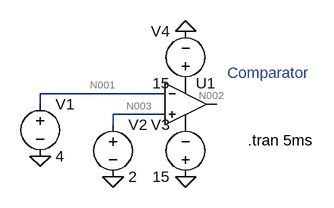
[diagram p0: schematic comparator.asc]
comparator.asc, the LTspice schematic file:
Version 4
SHEET 1 880 680
WIRE 160 144 -32 144
WIRE -32 160 -32 144
WIRE 240 160 224 160
WIRE 160 176 80 176
WIRE 80 192 80 176
FLAG -32 240 0
FLAG 80 272 0
FLAG 192 272 0
FLAG 192 48 0
SYMBOL Opamps\\UniversalOpamp2 192 160 R0
SYMATTR InstName U1
SYMBOL voltage -32 144 R0
WINDOW 123 0 0 Left 0
WINDOW 39 0 0 Left 0
SYMATTR InstName V1
SYMATTR Value 4
SYMBOL voltage 80 176 R0
WINDOW 123 0 0 Left 0
WINDOW 39 0 0 Left 0
SYMATTR InstName V2
SYMATTR Value 2
SYMBOL voltage 192 288 R180
WINDOW 0 24 96 Left 2
WINDOW 3 24 16 Left 2
WINDOW 123 0 0 Left 0
WINDOW 39 0 0 Left 0
SYMATTR InstName V3
SYMATTR Value 15
SYMBOL voltage 192 144 R180
WINDOW 0 24 96 Left 2
WINDOW 3 24 16 Left 2
WINDOW 123 0 0 Left 0
WINDOW 39 0 0 Left 0
SYMATTR InstName V4
SYMATTR Value 15
TEXT 288 216 Left 2 !.tran 5ms
TEXT 256 112 Left 2 ;Comparator

The netlist it stands for:
* comparator.asc
XU1 N003 N001 P001 P002 N002 level.2 Avol=1Meg GBW=10Meg Slew=10Meg ilimit=25m rail=0 Vos=0 phimargin=45 en=0 enk=0 in=0 ink=0 Rin=500Meg  ; pins IN+ IN- V+ V- OUT
V1 N001 0 4
V2 N003 0 2
V3 0 P002 15
V4 P001 0 15
.tran 5ms
* Comparator
.lib UniversalOpamps2.sub
.backanno
.end

* Results of the author's LTspice run, read from the files saved beside the schematic
* Operating Point, zero values left out:
*   V(n002) = -15 V
*   V(p001) = 15 V
*   V(p002) = -15 V
*   V(n001) = 4 V
*   V(n003) = 2 V
*   I(V4) = -3.475 µA
*   I(V3) = -3.287 µA
*   I(V2) = -4 nA
*   I(V1) = -8 nA
*   Ix(u1:1) = 4 nA
*   Ix(u1:2) = 8 nA
*   Ix(u1:3) = 3.475 µA
*   Ix(u1:4) = -3.287 µA